# EAGLE schematic Woodenmachine (EAGLE 9.2.2)
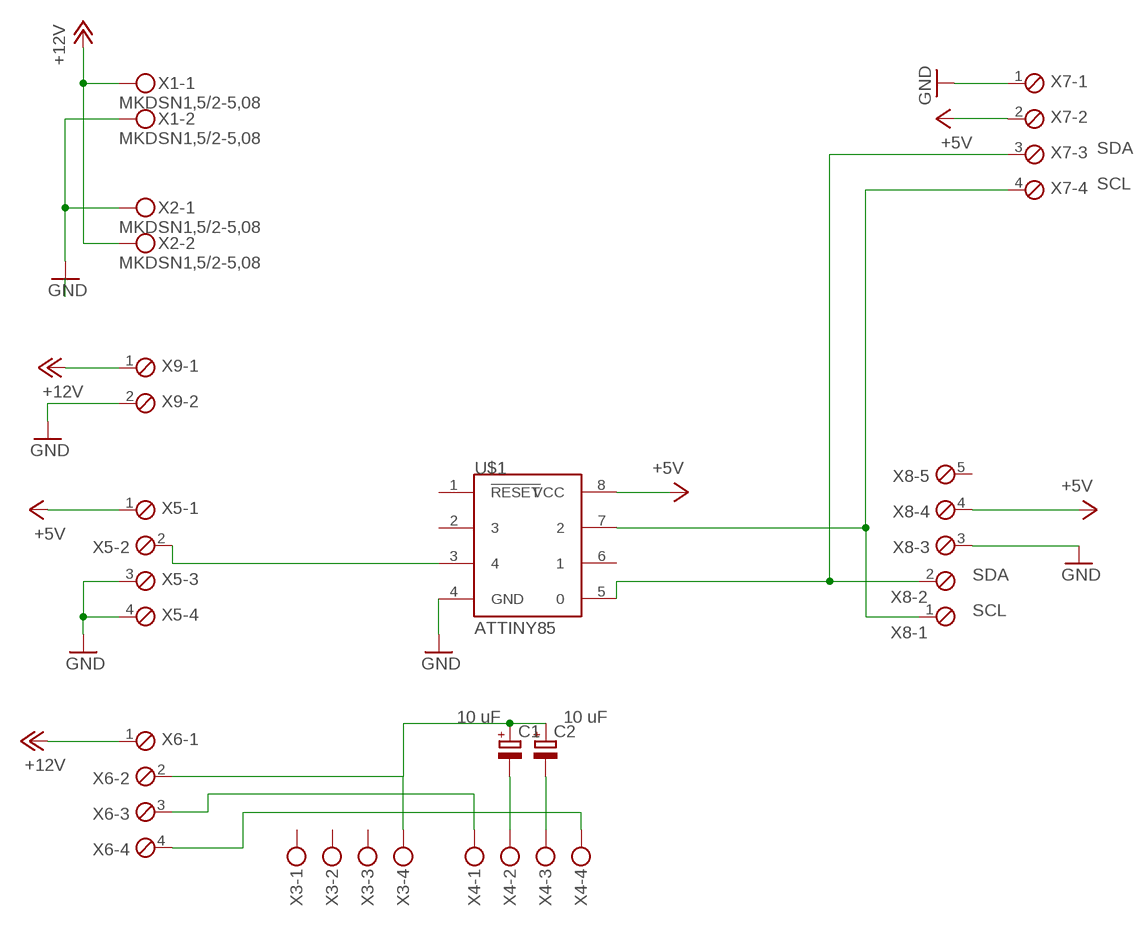
[diagram p0: schematic, sheet 1]

## Parts
C1  CPOL-EUE2.5-5  [E2,5-5]
C2  CPOL-EUE2.5-5  [E2,5-5]
U$1  ATTINY85  [8P3]
X1  MKDSN1,5/2-5,08  [MKDSN1,5/2-5,08]
X2  MKDSN1,5/2-5,08  [MKDSN1,5/2-5,08]
X3  MKDSN1,5/4-5,08  [MKDSN1,5/4-5,08]
X4  MKDSN1,5/4-5,08  [MKDSN1,5/4-5,08]
X5  MPT4  [4POL254]
X6  MPT4  [4POL254]
X7  MPT4  [4POL254]
X8  MPT5  [5POL254]
X9  MPT2  [2POL254]

## Nets
+5V: U$1.8(VCC) X5.1 X7.2 X8.4
+12V: X1.1 X2.2 X6.1 X9.1
GND: U$1.4(GND) X1.2 X2.1 X5.3 X5.4 X7.1 X8.3 X9.2
N$1: U$1.3 X5.2
N$2: U$1.7 X7.4 X8.1
N$3: U$1.5 X7.3 X8.2
N$4: C1.+ C2.+ X3.4 X6.2
N$5: C1.- X4.2
N$6: C2.- X4.3
N$7: X4.4 X6.4
N$8: X4.1 X6.3
Unconnected: U$1.1(!RESET) U$1.2 U$1.6 X3.1 X3.2 X3.3 X8.5

## Library data of the parts
C1 C2 = rcl:CPOL-EU: POLARIZED CAPACITOR, European symbol; CAP: 10 uF; SPICEPREFIX: C
U$1 = attiny85:ATTINY85
X1 = con-phoenix-508:MKDSN1,5/2-5,08: MKDSN 1,5/ 2-5,08 Printklemme Nennstrom: 13,5 A Nennspannung: 250 V Rastermaß: 5,08 mm Polzahl: 2 Anschlussart: Schraubanschluss Montage: Löten Anschlussrichtung Leiter/Platine: 0 ° Artikelnummer: 1729128 Source: http://eshop.phoenixcontact.com .. 1729128.pdf; E: GND
X2 = con-phoenix-508:MKDSN1,5/2-5,08: MKDSN 1,5/ 2-5,08 Printklemme Nennstrom: 13,5 A Nennspannung: 250 V Rastermaß: 5,08 mm Polzahl: 2 Anschlussart: Schraubanschluss Montage: Löten Anschlussrichtung Leiter/Platine: 0 ° Artikelnummer: 1729128 Source: http://eshop.phoenixcontact.com .. 1729128.pdf
X3 X4 = con-phoenix-508:MKDSN1,5/4-5,08: MKDSN 1,5/ 4-5,08 Printklemme Nennstrom: 13,5 A Nennspannung: 250 V Rastermaß: 5,08 mm Polzahl: 4 Anschlussart: Schraubanschluss Montage: Löten Anschlussrichtung Leiter/Platine: 0 ° Artikelnummer: 1729144 Source: http://eshop.phoenixcontact.com .. 1729144.pdf
X5 X6 = con-phoenix-254:MPT4: PHOENIX CONNECTOR; OC_FARNELL: unknown; OC_NEWARK: unknown
X7 = con-phoenix-254:MPT4: PHOENIX CONNECTOR; OC_FARNELL: unknown; OC_NEWARK: unknown; SCL: SCL; SDA: SDA
X8 = con-phoenix-254:MPT5: PHOENIX CONNECTOR; OC_FARNELL: unknown; OC_NEWARK: unknown; SCL: SCL; SDA: SDA
X9 = con-phoenix-254:MPT2: PHOENIX CONNECTOR; OC_FARNELL: unknown; OC_NEWARK: unknown